# Altium project Magnetic-Sequencer.PrjPcb
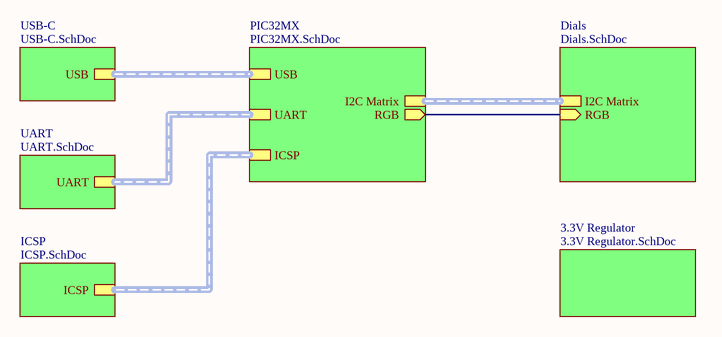
[diagram p0: Main.SchDoc]
Author: Seb Madgwick; Project: Magnetic Sequencer; Version: v1.1
8 sheets, 301 parts. Net scope: hierarchical (ports join the sheet entries above them; power ports are global).
Board file: Magnetic-Sequencer.PcbDoc
Sheets:
  Main.SchDoc
    Dials = Dials.SchDoc
      CH1 = Dial.SchDoc
      CH2 = Dial.SchDoc
      CH3 = Dial.SchDoc
      CH4 = Dial.SchDoc
      CH5 = Dial.SchDoc
      CH6 = Dial.SchDoc
      CH7 = Dial.SchDoc
      CH8 = Dial.SchDoc
      CH9 = Dial.SchDoc
      CH10 = Dial.SchDoc
      CH11 = Dial.SchDoc
      CH12 = Dial.SchDoc
      CH13 = Dial.SchDoc
      CH14 = Dial.SchDoc
      CH15 = Dial.SchDoc
      CH16 = Dial.SchDoc
      CH17 = Dial.SchDoc
      CH18 = Dial.SchDoc
      CH19 = Dial.SchDoc
      CH20 = Dial.SchDoc
      CH21 = Dial.SchDoc
      CH22 = Dial.SchDoc
      CH23 = Dial.SchDoc
      CH24 = Dial.SchDoc
      CH25 = Dial.SchDoc
      CH26 = Dial.SchDoc
      CH27 = Dial.SchDoc
      CH28 = Dial.SchDoc
      CH29 = Dial.SchDoc
      CH30 = Dial.SchDoc
      CH31 = Dial.SchDoc
      CH32 = Dial.SchDoc
      CH33 = Dial.SchDoc
      CH34 = Dial.SchDoc
      CH35 = Dial.SchDoc
      CH36 = Dial.SchDoc
      CH37 = Dial.SchDoc
      CH38 = Dial.SchDoc
      CH39 = Dial.SchDoc
      CH40 = Dial.SchDoc
      CH41 = Dial.SchDoc
      CH42 = Dial.SchDoc
      CH43 = Dial.SchDoc
      CH44 = Dial.SchDoc
      CH45 = Dial.SchDoc
      CH46 = Dial.SchDoc
      CH47 = Dial.SchDoc
      CH48 = Dial.SchDoc
      CH49 = Dial.SchDoc
      CH50 = Dial.SchDoc
      CH51 = Dial.SchDoc
      CH52 = Dial.SchDoc
      CH53 = Dial.SchDoc
      CH54 = Dial.SchDoc
      CH55 = Dial.SchDoc
      CH56 = Dial.SchDoc
      CH57 = Dial.SchDoc
      CH58 = Dial.SchDoc
      CH59 = Dial.SchDoc
      CH60 = Dial.SchDoc
      CH61 = Dial.SchDoc
      CH62 = Dial.SchDoc
      CH63 = Dial.SchDoc
      CH64 = Dial.SchDoc
    PIC32MX = PIC32MX.SchDoc
    USB-C = USB-C.SchDoc
    UART = UART.SchDoc
    3.3V Regulator = 3.3V Regulator.SchDoc
    ICSP = ICSP.SchDoc

## Sheet Main.SchDoc
size A4; SheetNumber: 1; SheetTotal: 8

### Sub-sheets
3.3V Regulator = 3.3V Regulator.SchDoc: no entries
Dials = Dials.SchDoc: I2C Matrix (harness I2C Matrix), RGB (in)
ICSP = ICSP.SchDoc: ICSP (harness ICSP)
PIC32MX = PIC32MX.SchDoc: I2C Matrix (harness I2C Matrix), RGB (out), USB (harness USB), ICSP (harness ICSP), UART (harness UART)
UART = UART.SchDoc: UART (harness UART)
USB-C = USB-C.SchDoc: USB (harness USB)

### Nets
RGB: sheet Dials/RGB, sheet PIC32MX/RGB

### Buses and harness runs
harness sheet Dials/I2C Matrix = sheet PIC32MX/I2C Matrix
harness sheet ICSP/ICSP = sheet PIC32MX/ICSP
harness sheet PIC32MX/UART = sheet UART/UART
harness sheet PIC32MX/USB = sheet USB-C/USB

### Notes on the sheet
- TITLE
- SIZE
- A4
- VARIANT
- PROJECT
- SHEET
- VERSION
- OF
- AUTHOR
- DATE

## Sheet Dials.SchDoc
size A3; SheetNumber: 6; SheetTotal: 8
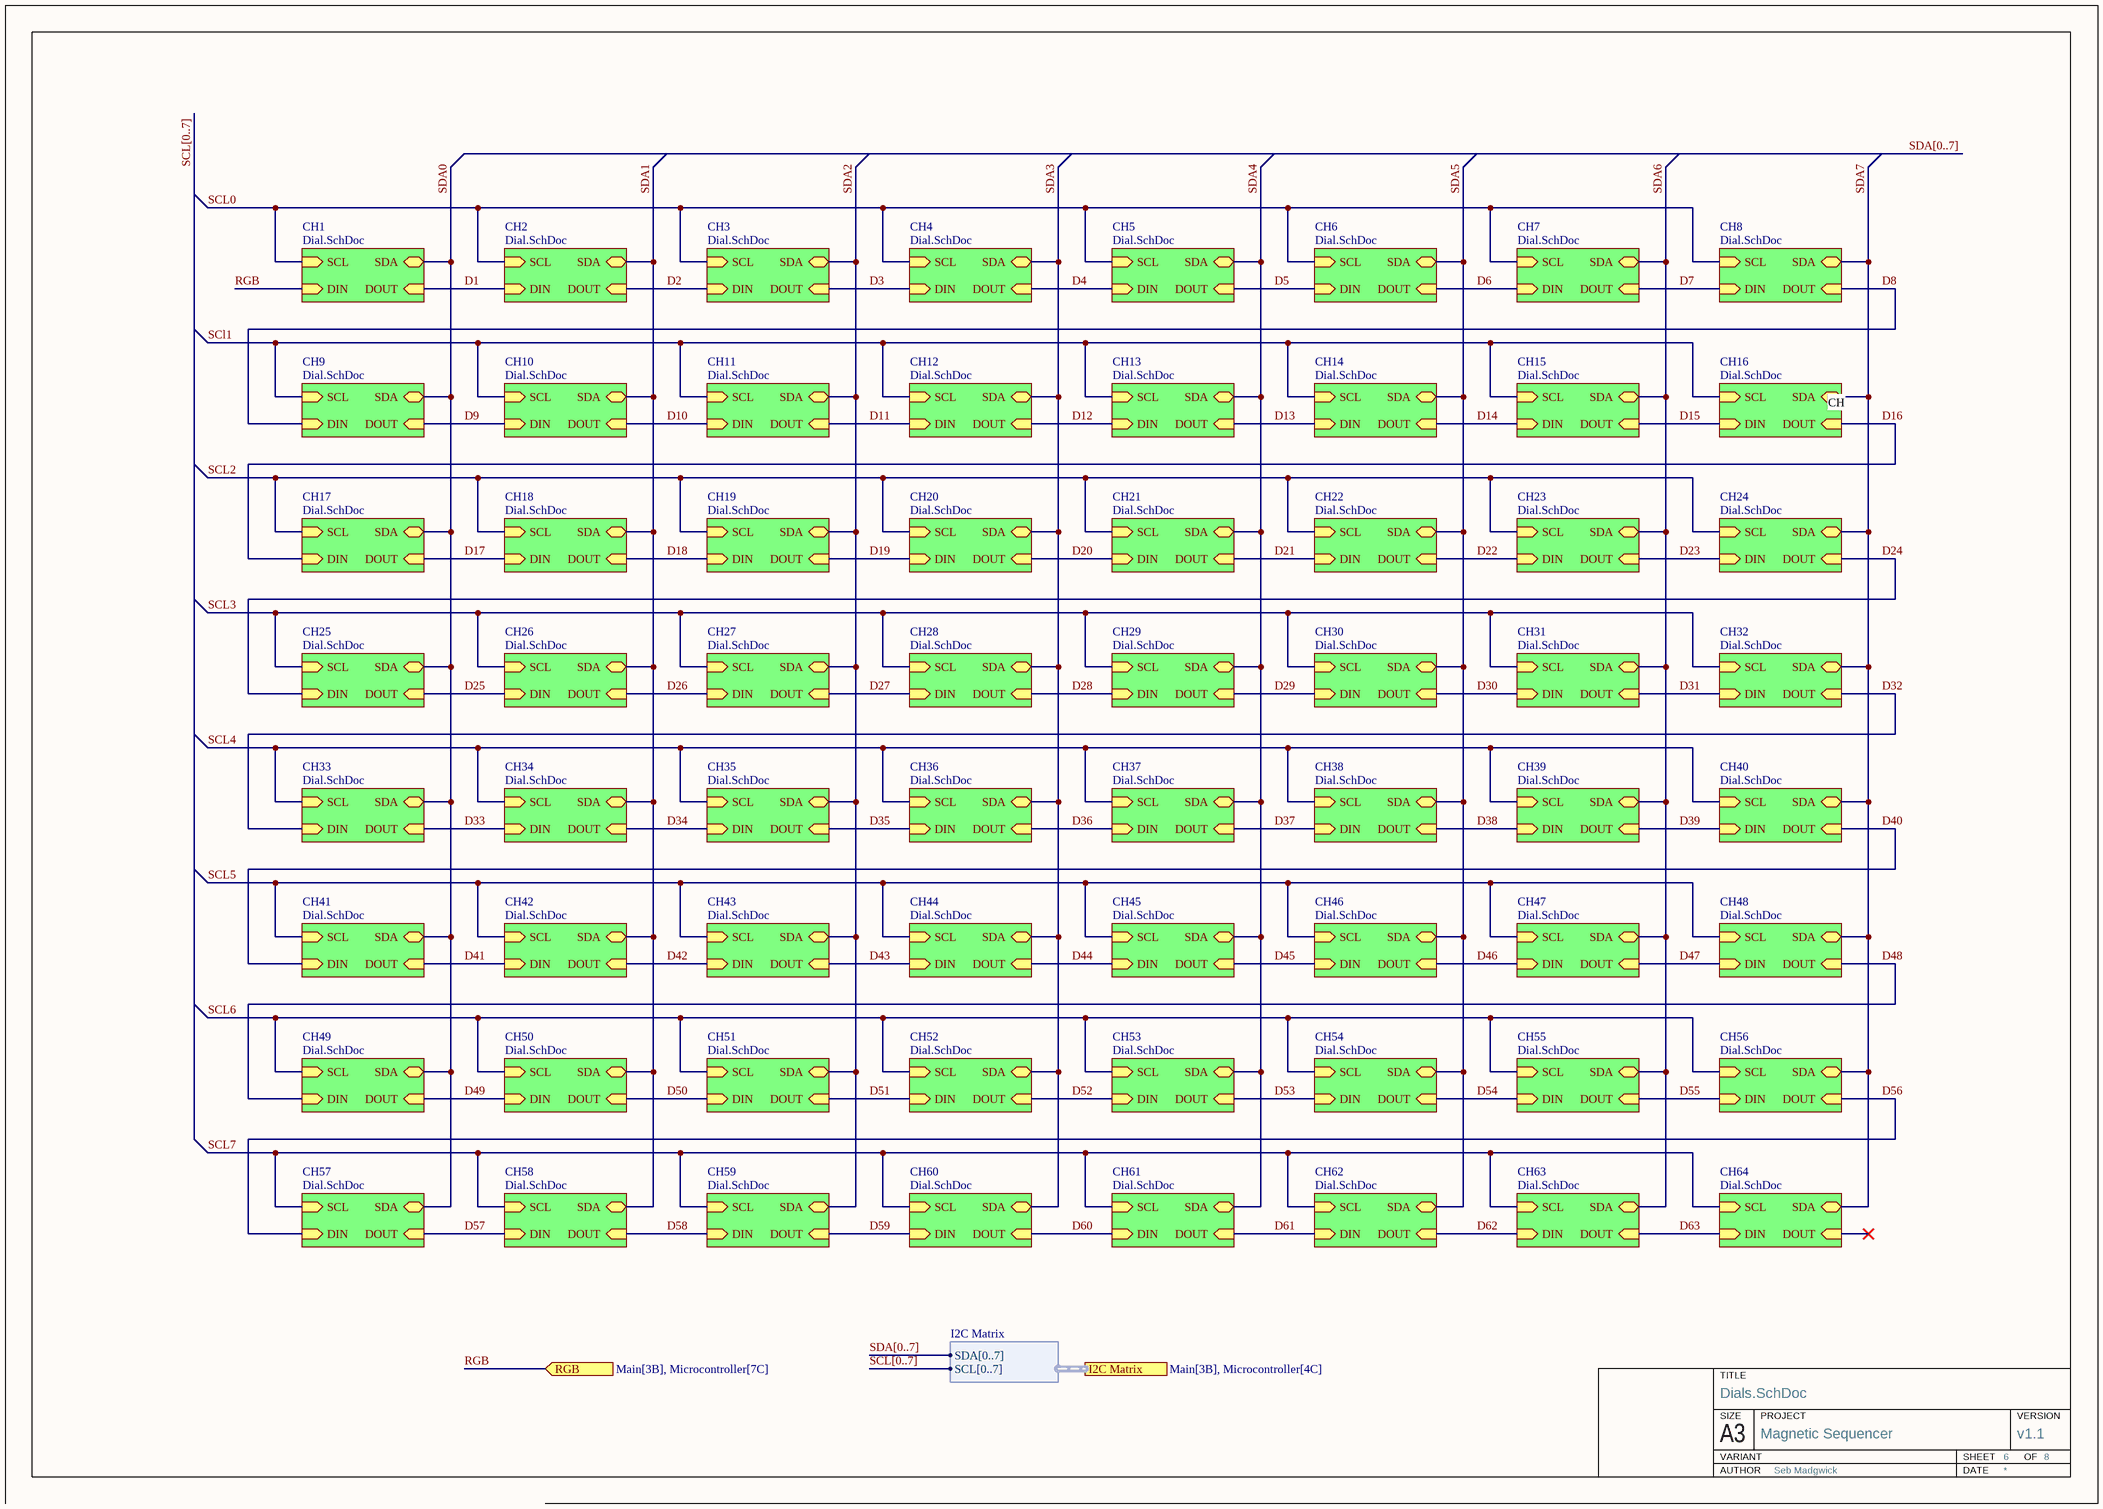
[diagram p1: Dials.SchDoc]

### Sub-sheets
CH1 = Dial.SchDoc: SCL (in), SDA (bidir), DIN (in), DOUT (in)
CH2 = Dial.SchDoc: SCL (in), SDA (bidir), DIN (in), DOUT (in)
CH3 = Dial.SchDoc: SCL (in), SDA (bidir), DIN (in), DOUT (in)
CH4 = Dial.SchDoc: SCL (in), SDA (bidir), DIN (in), DOUT (in)
CH5 = Dial.SchDoc: SCL (in), SDA (bidir), DIN (in), DOUT (in)
CH6 = Dial.SchDoc: SCL (in), SDA (bidir), DIN (in), DOUT (in)
CH7 = Dial.SchDoc: SCL (in), SDA (bidir), DIN (in), DOUT (in)
CH8 = Dial.SchDoc: SCL (in), SDA (bidir), DIN (in), DOUT (in)
CH9 = Dial.SchDoc: SCL (in), SDA (bidir), DIN (in), DOUT (in)
CH10 = Dial.SchDoc: SCL (in), SDA (bidir), DIN (in), DOUT (in)
CH11 = Dial.SchDoc: SCL (in), SDA (bidir), DIN (in), DOUT (in)
CH12 = Dial.SchDoc: SCL (in), SDA (bidir), DIN (in), DOUT (in)
CH13 = Dial.SchDoc: SCL (in), SDA (bidir), DIN (in), DOUT (in)
CH14 = Dial.SchDoc: SCL (in), SDA (bidir), DIN (in), DOUT (in)
CH15 = Dial.SchDoc: SCL (in), SDA (bidir), DIN (in), DOUT (in)
CH16 = Dial.SchDoc: SCL (in), SDA (bidir), DIN (in), DOUT (in)
CH17 = Dial.SchDoc: SCL (in), SDA (bidir), DIN (in), DOUT (in)
CH18 = Dial.SchDoc: SCL (in), SDA (bidir), DIN (in), DOUT (in)
CH19 = Dial.SchDoc: SCL (in), SDA (bidir), DIN (in), DOUT (in)
CH20 = Dial.SchDoc: SCL (in), SDA (bidir), DIN (in), DOUT (in)
CH21 = Dial.SchDoc: SCL (in), SDA (bidir), DIN (in), DOUT (in)
CH22 = Dial.SchDoc: SCL (in), SDA (bidir), DIN (in), DOUT (in)
CH23 = Dial.SchDoc: SCL (in), SDA (bidir), DIN (in), DOUT (in)
CH24 = Dial.SchDoc: SCL (in), SDA (bidir), DIN (in), DOUT (in)
CH25 = Dial.SchDoc: SCL (in), SDA (bidir), DIN (in), DOUT (in)
CH26 = Dial.SchDoc: SCL (in), SDA (bidir), DIN (in), DOUT (in)
CH27 = Dial.SchDoc: SCL (in), SDA (bidir), DIN (in), DOUT (in)
CH28 = Dial.SchDoc: SCL (in), SDA (bidir), DIN (in), DOUT (in)
CH29 = Dial.SchDoc: SCL (in), SDA (bidir), DIN (in), DOUT (in)
CH30 = Dial.SchDoc: SCL (in), SDA (bidir), DIN (in), DOUT (in)
CH31 = Dial.SchDoc: SCL (in), SDA (bidir), DIN (in), DOUT (in)
CH32 = Dial.SchDoc: SCL (in), SDA (bidir), DIN (in), DOUT (in)
CH33 = Dial.SchDoc: SCL (in), SDA (bidir), DIN (in), DOUT (in)
CH34 = Dial.SchDoc: SCL (in), SDA (bidir), DIN (in), DOUT (in)
CH35 = Dial.SchDoc: SCL (in), SDA (bidir), DIN (in), DOUT (in)
CH36 = Dial.SchDoc: SCL (in), SDA (bidir), DIN (in), DOUT (in)
CH37 = Dial.SchDoc: SCL (in), SDA (bidir), DIN (in), DOUT (in)
CH38 = Dial.SchDoc: SCL (in), SDA (bidir), DIN (in), DOUT (in)
CH39 = Dial.SchDoc: SCL (in), SDA (bidir), DIN (in), DOUT (in)
CH40 = Dial.SchDoc: SCL (in), SDA (bidir), DIN (in), DOUT (in)
CH41 = Dial.SchDoc: SCL (in), SDA (bidir), DIN (in), DOUT (in)
CH42 = Dial.SchDoc: SCL (in), SDA (bidir), DIN (in), DOUT (in)
CH43 = Dial.SchDoc: SCL (in), SDA (bidir), DIN (in), DOUT (in)
CH44 = Dial.SchDoc: SCL (in), SDA (bidir), DIN (in), DOUT (in)
CH45 = Dial.SchDoc: SCL (in), SDA (bidir), DIN (in), DOUT (in)
CH46 = Dial.SchDoc: SCL (in), SDA (bidir), DIN (in), DOUT (in)
CH47 = Dial.SchDoc: SCL (in), SDA (bidir), DIN (in), DOUT (in)
CH48 = Dial.SchDoc: SCL (in), SDA (bidir), DIN (in), DOUT (in)
CH49 = Dial.SchDoc: SCL (in), SDA (bidir), DIN (in), DOUT (in)
CH50 = Dial.SchDoc: SCL (in), SDA (bidir), DIN (in), DOUT (in)
CH51 = Dial.SchDoc: SCL (in), SDA (bidir), DIN (in), DOUT (in)
CH52 = Dial.SchDoc: SCL (in), SDA (bidir), DIN (in), DOUT (in)
CH53 = Dial.SchDoc: SCL (in), SDA (bidir), DIN (in), DOUT (in)
CH54 = Dial.SchDoc: SCL (in), SDA (bidir), DIN (in), DOUT (in)
CH55 = Dial.SchDoc: SCL (in), SDA (bidir), DIN (in), DOUT (in)
CH56 = Dial.SchDoc: SCL (in), SDA (bidir), DIN (in), DOUT (in)
CH57 = Dial.SchDoc: SCL (in), SDA (bidir), DIN (in), DOUT (in)
CH58 = Dial.SchDoc: SCL (in), SDA (bidir), DIN (in), DOUT (in)
CH59 = Dial.SchDoc: SCL (in), SDA (bidir), DIN (in), DOUT (in)
CH60 = Dial.SchDoc: SCL (in), SDA (bidir), DIN (in), DOUT (in)
CH61 = Dial.SchDoc: SCL (in), SDA (bidir), DIN (in), DOUT (in)
CH62 = Dial.SchDoc: SCL (in), SDA (bidir), DIN (in), DOUT (in)
CH63 = Dial.SchDoc: SCL (in), SDA (bidir), DIN (in), DOUT (in)
CH64 = Dial.SchDoc: SCL (in), SDA (bidir), DIN (in), DOUT (in)

### Ports
I2C Matrix (harness I2C Matrix, see Main[3B], Microcontroller[4C]), RGB (in, see Main[3B], Microcontroller[7C])

### Harnesses
I2C Matrix: SDA[0..7], SCL[0..7]

### Nets
D1: sheet CH1/DOUT, sheet CH2/DIN
D2: sheet CH2/DOUT, sheet CH3/DIN
D3: sheet CH3/DOUT, sheet CH4/DIN
D4: sheet CH4/DOUT, sheet CH5/DIN
D5: sheet CH5/DOUT, sheet CH6/DIN
D6: sheet CH6/DOUT, sheet CH7/DIN
D7: sheet CH7/DOUT, sheet CH8/DIN
D8: sheet CH8/DOUT, sheet CH9/DIN
D9: sheet CH9/DOUT, sheet CH10/DIN
D10: sheet CH10/DOUT, sheet CH11/DIN
D11: sheet CH11/DOUT, sheet CH12/DIN
D12: sheet CH12/DOUT, sheet CH13/DIN
D13: sheet CH13/DOUT, sheet CH14/DIN
D14: sheet CH14/DOUT, sheet CH15/DIN
D15: sheet CH15/DOUT, sheet CH16/DIN
D16: sheet CH16/DOUT, sheet CH17/DIN
D17: sheet CH17/DOUT, sheet CH18/DIN
D18: sheet CH18/DOUT, sheet CH19/DIN
D19: sheet CH19/DOUT, sheet CH20/DIN
D20: sheet CH20/DOUT, sheet CH21/DIN
D21: sheet CH21/DOUT, sheet CH22/DIN
D22: sheet CH22/DOUT, sheet CH23/DIN
D23: sheet CH23/DOUT, sheet CH24/DIN
D24: sheet CH24/DOUT, sheet CH25/DIN
D25: sheet CH25/DOUT, sheet CH26/DIN
D26: sheet CH26/DOUT, sheet CH27/DIN
D27: sheet CH27/DOUT, sheet CH28/DIN
D28: sheet CH28/DOUT, sheet CH29/DIN
D29: sheet CH29/DOUT, sheet CH30/DIN
D30: sheet CH30/DOUT, sheet CH31/DIN
D31: sheet CH31/DOUT, sheet CH32/DIN
D32: sheet CH32/DOUT, sheet CH33/DIN
D33: sheet CH33/DOUT, sheet CH34/DIN
D34: sheet CH34/DOUT, sheet CH35/DIN
D35: sheet CH35/DOUT, sheet CH36/DIN
D36: sheet CH36/DOUT, sheet CH37/DIN
D37: sheet CH37/DOUT, sheet CH38/DIN
D38: sheet CH38/DOUT, sheet CH39/DIN
D39: sheet CH39/DOUT, sheet CH40/DIN
D40: sheet CH40/DOUT, sheet CH41/DIN
D41: sheet CH41/DOUT, sheet CH42/DIN
D42: sheet CH42/DOUT, sheet CH43/DIN
D43: sheet CH43/DOUT, sheet CH44/DIN
D44: sheet CH44/DOUT, sheet CH45/DIN
D45: sheet CH45/DOUT, sheet CH46/DIN
D46: sheet CH46/DOUT, sheet CH47/DIN
D47: sheet CH47/DOUT, sheet CH48/DIN
D48: sheet CH48/DOUT, sheet CH49/DIN
D49: sheet CH49/DOUT, sheet CH50/DIN
D50: sheet CH50/DOUT, sheet CH51/DIN
D51: sheet CH51/DOUT, sheet CH52/DIN
D52: sheet CH52/DOUT, sheet CH53/DIN
D53: sheet CH53/DOUT, sheet CH54/DIN
D54: sheet CH54/DOUT, sheet CH55/DIN
D55: sheet CH55/DOUT, sheet CH56/DIN
D56: sheet CH56/DOUT, sheet CH57/DIN
D57: sheet CH57/DOUT, sheet CH58/DIN
D58: sheet CH58/DOUT, sheet CH59/DIN
D59: sheet CH59/DOUT, sheet CH60/DIN
D60: sheet CH60/DOUT, sheet CH61/DIN
D61: sheet CH61/DOUT, sheet CH62/DIN
D62: sheet CH62/DOUT, sheet CH63/DIN
D63: sheet CH63/DOUT, sheet CH64/DIN
RGB: port RGB, sheet CH1/DIN
SCL0: sheet CH1/SCL, sheet CH2/SCL, sheet CH3/SCL, sheet CH4/SCL, sheet CH5/SCL, sheet CH6/SCL, sheet CH7/SCL, sheet CH8/SCL
SCl1: sheet CH9/SCL, sheet CH10/SCL, sheet CH11/SCL, sheet CH12/SCL, sheet CH13/SCL, sheet CH14/SCL, sheet CH15/SCL, sheet CH16/SCL
SCL2: sheet CH17/SCL, sheet CH18/SCL, sheet CH19/SCL, sheet CH20/SCL, sheet CH21/SCL, sheet CH22/SCL, sheet CH23/SCL, sheet CH24/SCL
SCL3: sheet CH25/SCL, sheet CH26/SCL, sheet CH27/SCL, sheet CH28/SCL, sheet CH29/SCL, sheet CH30/SCL, sheet CH31/SCL, sheet CH32/SCL
SCL4: sheet CH33/SCL, sheet CH34/SCL, sheet CH35/SCL, sheet CH36/SCL, sheet CH37/SCL, sheet CH38/SCL, sheet CH39/SCL, sheet CH40/SCL
SCL5: sheet CH41/SCL, sheet CH42/SCL, sheet CH43/SCL, sheet CH44/SCL, sheet CH45/SCL, sheet CH46/SCL, sheet CH47/SCL, sheet CH48/SCL
SCL6: sheet CH49/SCL, sheet CH50/SCL, sheet CH51/SCL, sheet CH52/SCL, sheet CH53/SCL, sheet CH54/SCL, sheet CH55/SCL, sheet CH56/SCL
SCL7: sheet CH57/SCL, sheet CH58/SCL, sheet CH59/SCL, sheet CH60/SCL, sheet CH61/SCL, sheet CH62/SCL, sheet CH63/SCL, sheet CH64/SCL
SDA0: sheet CH1/SDA, sheet CH9/SDA, sheet CH17/SDA, sheet CH25/SDA, sheet CH33/SDA, sheet CH41/SDA, sheet CH49/SDA, sheet CH57/SDA
SDA1: sheet CH2/SDA, sheet CH10/SDA, sheet CH18/SDA, sheet CH26/SDA, sheet CH34/SDA, sheet CH42/SDA, sheet CH50/SDA, sheet CH58/SDA
SDA2: sheet CH3/SDA, sheet CH11/SDA, sheet CH19/SDA, sheet CH27/SDA, sheet CH35/SDA, sheet CH43/SDA, sheet CH51/SDA, sheet CH59/SDA
SDA3: sheet CH4/SDA, sheet CH12/SDA, sheet CH20/SDA, sheet CH28/SDA, sheet CH36/SDA, sheet CH44/SDA, sheet CH52/SDA, sheet CH60/SDA
SDA4: sheet CH5/SDA, sheet CH13/SDA, sheet CH21/SDA, sheet CH29/SDA, sheet CH37/SDA, sheet CH45/SDA, sheet CH53/SDA, sheet CH61/SDA
SDA5: sheet CH6/SDA, sheet CH14/SDA, sheet CH22/SDA, sheet CH30/SDA, sheet CH38/SDA, sheet CH46/SDA, sheet CH54/SDA, sheet CH62/SDA
SDA6: sheet CH7/SDA, sheet CH15/SDA, sheet CH23/SDA, sheet CH31/SDA, sheet CH39/SDA, sheet CH47/SDA, sheet CH55/SDA, sheet CH63/SDA
SDA7: sheet CH8/SDA, sheet CH16/SDA, sheet CH24/SDA, sheet CH32/SDA, sheet CH40/SDA, sheet CH48/SDA, sheet CH56/SDA, sheet CH64/SDA

### Buses and harness runs
bus SCL[0..7]
bus SDA[0..7]

### Notes on the sheet
- CH
- TITLE
- SIZE
- A3
- VARIANT
- PROJECT
- SHEET
- VERSION
- OF
- AUTHOR
- DATE

## Sheet Dial.SchDoc
size A4; SheetNumber: 7; SheetTotal: 8
Used 64 times, as channels Dials/CH1, Dials/CH2, Dials/CH3, Dials/CH4, Dials/CH5, Dials/CH6, Dials/CH7, Dials/CH8, Dials/CH9, Dials/CH10, Dials/CH11, Dials/CH12, Dials/CH13, Dials/CH14, Dials/CH15, Dials/CH16, Dials/CH17, Dials/CH18, Dials/CH19, Dials/CH20, Dials/CH21, Dials/CH22, Dials/CH23, Dials/CH24, Dials/CH25, Dials/CH26, Dials/CH27, Dials/CH28, Dials/CH29, Dials/CH30, Dials/CH31, Dials/CH32, Dials/CH33, Dials/CH34, Dials/CH35, Dials/CH36, Dials/CH37, Dials/CH38, Dials/CH39, Dials/CH40, Dials/CH41, Dials/CH42, Dials/CH43, Dials/CH44, Dials/CH45, Dials/CH46, Dials/CH47, Dials/CH48, Dials/CH49, Dials/CH50, Dials/CH51, Dials/CH52, Dials/CH53, Dials/CH54, Dials/CH55, Dials/CH56, Dials/CH57, Dials/CH58, Dials/CH59, Dials/CH60, Dials/CH61, Dials/CH62, Dials/CH63, Dials/CH64. Parts and nets are listed once, with the designators drawn on the sheet.
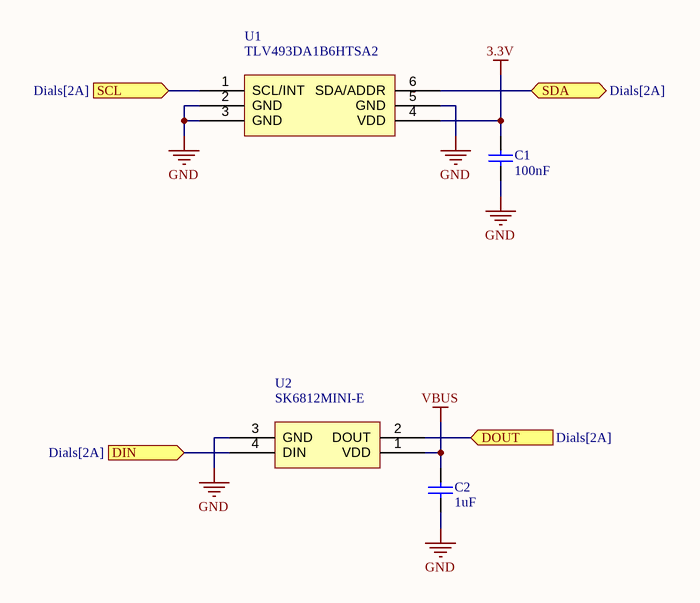
[diagram p2: Dial.SchDoc]

### Parts
C1  100nF  [Capacitor 0603]
C2  1uF  [Capacitor 0603]
U1  TLV493DA1B6HTSA2  [SOT-23-6]
U2  SK6812MINI-E  [SK6812MINI-E]

### Ports
DIN (in, see Dials[2A]), DOUT (in, see Dials[2A]), SCL (in, see Dials[2A]), SDA (bidir, see Dials[2A])

### Nets
3.3V: C1.2 U1.4(VDD)
GND: C1.1 C2.1 U1.2(GND) U1.3(GND) U1.5(GND) U2.3(GND)
VBUS: C2.2 U2.1(VDD)
DIN: U2.4(DIN) ; port DIN
DOUT: U2.2(DOUT) ; port DOUT
SCL: U1.1(SCL/INT) ; port SCL
SDA: U1.6(SDA/ADDR) ; port SDA

### Channels
Dials/CH1: designators end in _CH1; ports DIN=RGB DOUT=D1 SCL=SCL0 SDA=SDA0
Dials/CH2: designators end in _CH2; ports DIN=D1 DOUT=D2 SCL=SCL0 SDA=SDA1
Dials/CH3: designators end in _CH3; ports DIN=D2 DOUT=D3 SCL=SCL0 SDA=SDA2
Dials/CH4: designators end in _CH4; ports DIN=D3 DOUT=D4 SCL=SCL0 SDA=SDA3
Dials/CH5: designators end in _CH5; ports DIN=D4 DOUT=D5 SCL=SCL0 SDA=SDA4
Dials/CH6: designators end in _CH6; ports DIN=D5 DOUT=D6 SCL=SCL0 SDA=SDA5
Dials/CH7: designators end in _CH7; ports DIN=D6 DOUT=D7 SCL=SCL0 SDA=SDA6
Dials/CH8: designators end in _CH8; ports DIN=D7 DOUT=D8 SCL=SCL0 SDA=SDA7
Dials/CH9: designators end in _CH9; ports DIN=D8 DOUT=D9 SCL=SCl1 SDA=SDA0
Dials/CH10: designators end in _CH10; ports DIN=D9 DOUT=D10 SCL=SCl1 SDA=SDA1
Dials/CH11: designators end in _CH11; ports DIN=D10 DOUT=D11 SCL=SCl1 SDA=SDA2
Dials/CH12: designators end in _CH12; ports DIN=D11 DOUT=D12 SCL=SCl1 SDA=SDA3
Dials/CH13: designators end in _CH13; ports DIN=D12 DOUT=D13 SCL=SCl1 SDA=SDA4
Dials/CH14: designators end in _CH14; ports DIN=D13 DOUT=D14 SCL=SCl1 SDA=SDA5
Dials/CH15: designators end in _CH15; ports DIN=D14 DOUT=D15 SCL=SCl1 SDA=SDA6
Dials/CH16: designators end in _CH16; ports DIN=D15 DOUT=D16 SCL=SCl1 SDA=SDA7
Dials/CH17: designators end in _CH17; ports DIN=D16 DOUT=D17 SCL=SCL2 SDA=SDA0
Dials/CH18: designators end in _CH18; ports DIN=D17 DOUT=D18 SCL=SCL2 SDA=SDA1
Dials/CH19: designators end in _CH19; ports DIN=D18 DOUT=D19 SCL=SCL2 SDA=SDA2
Dials/CH20: designators end in _CH20; ports DIN=D19 DOUT=D20 SCL=SCL2 SDA=SDA3
Dials/CH21: designators end in _CH21; ports DIN=D20 DOUT=D21 SCL=SCL2 SDA=SDA4
Dials/CH22: designators end in _CH22; ports DIN=D21 DOUT=D22 SCL=SCL2 SDA=SDA5
Dials/CH23: designators end in _CH23; ports DIN=D22 DOUT=D23 SCL=SCL2 SDA=SDA6
Dials/CH24: designators end in _CH24; ports DIN=D23 DOUT=D24 SCL=SCL2 SDA=SDA7
Dials/CH25: designators end in _CH25; ports DIN=D24 DOUT=D25 SCL=SCL3 SDA=SDA0
Dials/CH26: designators end in _CH26; ports DIN=D25 DOUT=D26 SCL=SCL3 SDA=SDA1
Dials/CH27: designators end in _CH27; ports DIN=D26 DOUT=D27 SCL=SCL3 SDA=SDA2
Dials/CH28: designators end in _CH28; ports DIN=D27 DOUT=D28 SCL=SCL3 SDA=SDA3
Dials/CH29: designators end in _CH29; ports DIN=D28 DOUT=D29 SCL=SCL3 SDA=SDA4
Dials/CH30: designators end in _CH30; ports DIN=D29 DOUT=D30 SCL=SCL3 SDA=SDA5
Dials/CH31: designators end in _CH31; ports DIN=D30 DOUT=D31 SCL=SCL3 SDA=SDA6
Dials/CH32: designators end in _CH32; ports DIN=D31 DOUT=D32 SCL=SCL3 SDA=SDA7
Dials/CH33: designators end in _CH33; ports DIN=D32 DOUT=D33 SCL=SCL4 SDA=SDA0
Dials/CH34: designators end in _CH34; ports DIN=D33 DOUT=D34 SCL=SCL4 SDA=SDA1
Dials/CH35: designators end in _CH35; ports DIN=D34 DOUT=D35 SCL=SCL4 SDA=SDA2
Dials/CH36: designators end in _CH36; ports DIN=D35 DOUT=D36 SCL=SCL4 SDA=SDA3
Dials/CH37: designators end in _CH37; ports DIN=D36 DOUT=D37 SCL=SCL4 SDA=SDA4
Dials/CH38: designators end in _CH38; ports DIN=D37 DOUT=D38 SCL=SCL4 SDA=SDA5
Dials/CH39: designators end in _CH39; ports DIN=D38 DOUT=D39 SCL=SCL4 SDA=SDA6
Dials/CH40: designators end in _CH40; ports DIN=D39 DOUT=D40 SCL=SCL4 SDA=SDA7
Dials/CH41: designators end in _CH41; ports DIN=D40 DOUT=D41 SCL=SCL5 SDA=SDA0
Dials/CH42: designators end in _CH42; ports DIN=D41 DOUT=D42 SCL=SCL5 SDA=SDA1
Dials/CH43: designators end in _CH43; ports DIN=D42 DOUT=D43 SCL=SCL5 SDA=SDA2
Dials/CH44: designators end in _CH44; ports DIN=D43 DOUT=D44 SCL=SCL5 SDA=SDA3
Dials/CH45: designators end in _CH45; ports DIN=D44 DOUT=D45 SCL=SCL5 SDA=SDA4
Dials/CH46: designators end in _CH46; ports DIN=D45 DOUT=D46 SCL=SCL5 SDA=SDA5
Dials/CH47: designators end in _CH47; ports DIN=D46 DOUT=D47 SCL=SCL5 SDA=SDA6
Dials/CH48: designators end in _CH48; ports DIN=D47 DOUT=D48 SCL=SCL5 SDA=SDA7
Dials/CH49: designators end in _CH49; ports DIN=D48 DOUT=D49 SCL=SCL6 SDA=SDA0
Dials/CH50: designators end in _CH50; ports DIN=D49 DOUT=D50 SCL=SCL6 SDA=SDA1
Dials/CH51: designators end in _CH51; ports DIN=D50 DOUT=D51 SCL=SCL6 SDA=SDA2
Dials/CH52: designators end in _CH52; ports DIN=D51 DOUT=D52 SCL=SCL6 SDA=SDA3
Dials/CH53: designators end in _CH53; ports DIN=D52 DOUT=D53 SCL=SCL6 SDA=SDA4
Dials/CH54: designators end in _CH54; ports DIN=D53 DOUT=D54 SCL=SCL6 SDA=SDA5
Dials/CH55: designators end in _CH55; ports DIN=D54 DOUT=D55 SCL=SCL6 SDA=SDA6
Dials/CH56: designators end in _CH56; ports DIN=D55 DOUT=D56 SCL=SCL6 SDA=SDA7
Dials/CH57: designators end in _CH57; ports DIN=D56 DOUT=D57 SCL=SCL7 SDA=SDA0
Dials/CH58: designators end in _CH58; ports DIN=D57 DOUT=D58 SCL=SCL7 SDA=SDA1
Dials/CH59: designators end in _CH59; ports DIN=D58 DOUT=D59 SCL=SCL7 SDA=SDA2
Dials/CH60: designators end in _CH60; ports DIN=D59 DOUT=D60 SCL=SCL7 SDA=SDA3
Dials/CH61: designators end in _CH61; ports DIN=D60 DOUT=D61 SCL=SCL7 SDA=SDA4
Dials/CH62: designators end in _CH62; ports DIN=D61 DOUT=D62 SCL=SCL7 SDA=SDA5
Dials/CH63: designators end in _CH63; ports DIN=D62 DOUT=D63 SCL=SCL7 SDA=SDA6
Dials/CH64: designators end in _CH64; ports DIN=D63 DOUT=NetU2_CH64_2 SCL=SCL7 SDA=SDA7

### Notes on the sheet
- TITLE
- SIZE
- A4
- VARIANT
- PROJECT
- SHEET
- VERSION
- OF
- AUTHOR
- DATE

### Library data of the parts
C1 C2 = Capacitor

## Sheet PIC32MX.SchDoc
size A3; SheetNumber: 2; SheetTotal: 8
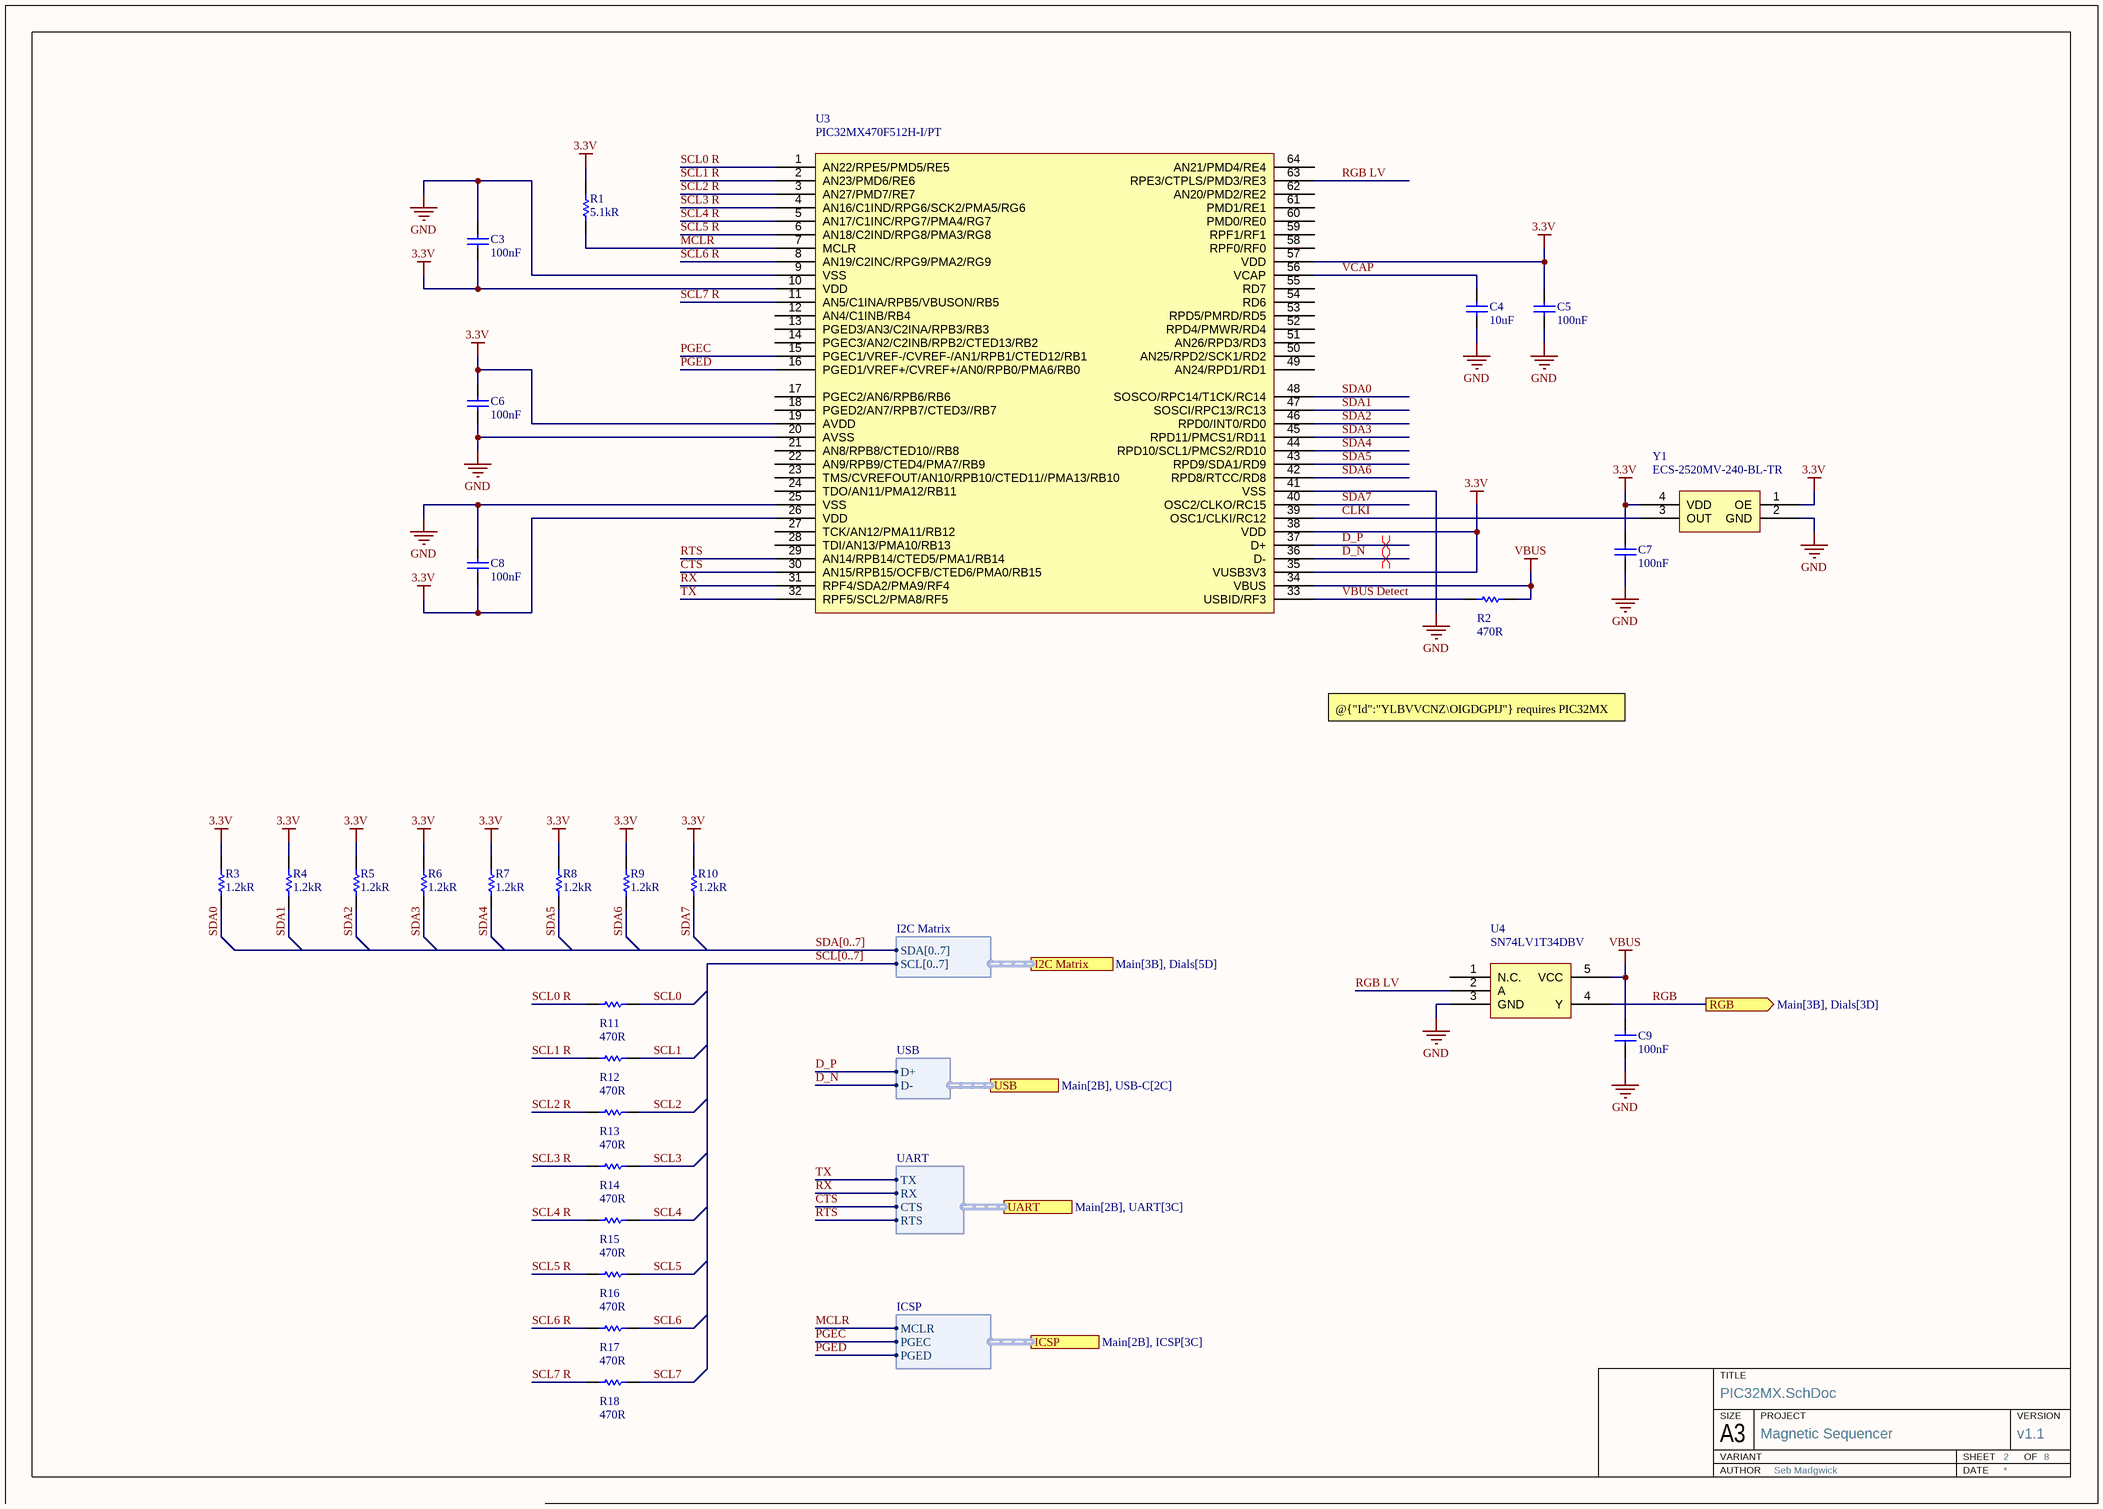
[diagram p3: PIC32MX.SchDoc]

### Parts
C3  100nF  [Capacitor 0603]
C4  10uF  [Capacitor 0603]
C5  100nF  [Capacitor 0603]
C6  100nF  [Capacitor 0603]
C7  100nF  [Capacitor 0603]
C8  100nF  [Capacitor 0603]
C9  100nF  [Capacitor 0603]
R1  5.1kR  [Resistor 0603]
R2  470R  [Resistor 0603]
R3  1.2kR  [Resistor 0603]
R4  1.2kR  [Resistor 0603]
R5  1.2kR  [Resistor 0603]
R6  1.2kR  [Resistor 0603]
R7  1.2kR  [Resistor 0603]
R8  1.2kR  [Resistor 0603]
R9  1.2kR  [Resistor 0603]
R10  1.2kR  [Resistor 0603]
R11  470R  [Resistor 0603]
R12  470R  [Resistor 0603]
R13  470R  [Resistor 0603]
R14  470R  [Resistor 0603]
R15  470R  [Resistor 0603]
R16  470R  [Resistor 0603]
R17  470R  [Resistor 0603]
R18  470R  [Resistor 0603]
U3  PIC32MX470F512H-I/PT  [TQFP-64]
U4  SN74LV1T34DBV  [SOT-23-5]
Y1  ECS-2520MV-240-BL-TR  [ECS-2520MV-240-BL-TR]

### Ports
I2C Matrix (harness I2C Matrix, see Main[3B], Dials[5D]), ICSP (harness ICSP, see Main[2B], ICSP[3C]), RGB (out, see Main[3B], Dials[3D]), UART (harness UART, see Main[2B], UART[3C]), USB (harness USB, see Main[2B], USB-C[2C])

### Harnesses
I2C Matrix: SDA[0..7], SCL[0..7]
USB: D+, D-
ICSP: MCLR, PGEC, PGED
UART: TX, RX, CTS, RTS

### Nets
3.3V: C3.1 C5.2 C6.2 C7.2 C8.1 R1.2 R3.2 R4.2 R5.2 R6.2 R7.2 R8.2 R9.2 R10.2 U3.10(VDD) U3.19(AVDD) U3.26(VDD) U3.35(VUSB3V3) U3.38(VDD) U3.57(VDD) Y1.1(OE) Y1.4(VDD)
GND: C3.2 C4.1 C5.1 C6.1 C7.1 C8.2 C9.1 U3.9(VSS) U3.20(AVSS) U3.25(VSS) U3.41(VSS) U4.3(GND) Y1.2(GND)
VBUS: C9.2 R2.2 U3.34(VBUS) U4.5(VCC)
CLKI: U3.39(OSC1/CLKI/RC12) Y1.3(OUT)
CTS: U3.30(AN15/RPB15/OCFB/CTED6/PMA0/RB15) ; port UART.CTS
D_N: U3.36(D-) ; port USB.D-
D_P: U3.37(D+) ; port USB.D+
MCLR: R1.1 U3.7(MCLR) ; port ICSP.MCLR
PGEC: U3.15(PGEC1/VREF-/CVREF-/AN1/RPB1/CTED12/RB1) ; port ICSP.PGEC
PGED: U3.16(PGED1/VREF+/CVREF+/AN0/RPB0/PMA6/RB0) ; port ICSP.PGED
RGB: U4.4(Y) ; port RGB
RGB LV: U3.63(RPE3/CTPLS/PMD3/RE3) U4.2(A)
RTS: U3.29(AN14/RPB14/CTED5/PMA1/RB14) ; port UART.RTS
RX: U3.31(RPF4/SDA2/PMA9/RF4) ; port UART.RX
SCL0: R11.2
SCL0 R: R11.1 U3.1(AN22/RPE5/PMD5/RE5)
SCl1: R12.2
SCL1 R: R12.1 U3.2(AN23/PMD6/RE6)
SCL2: R13.2
SCL2 R: R13.1 U3.3(AN27/PMD7/RE7)
SCL3: R14.2
SCL3 R: R14.1 U3.4(AN16/C1IND/RPG6/SCK2/PMA5/RG6)
SCL4: R15.2
SCL4 R: R15.1 U3.5(AN17/C1INC/RPG7/PMA4/RG7)
SCL5: R16.2
SCL5 R: R16.1 U3.6(AN18/C2IND/RPG8/PMA3/RG8)
SCL6: R17.2
SCL6 R: R17.1 U3.8(AN19/C2INC/RPG9/PMA2/RG9)
SCL7: R18.2
SCL7 R: R18.1 U3.11(AN5/C1INA/RPB5/VBUSON/RB5)
SDA0: R3.1 U3.48(SOSCO/RPC14/T1CK/RC14)
SDA1: R4.1 U3.47(SOSCI/RPC13/RC13)
SDA2: R5.1 U3.46(RPD0/INT0/RD0)
SDA3: R6.1 U3.45(RPD11/PMCS1/RD11)
SDA4: R7.1 U3.44(RPD10/SCL1/PMCS2/RD10)
SDA5: R8.1 U3.43(RPD9/SDA1/RD9)
SDA6: R9.1 U3.42(RPD8/RTCC/RD8)
SDA7: R10.1 U3.40(OSC2/CLKO/RC15)
TX: U3.32(RPF5/SCL2/PMA8/RF5) ; port UART.TX
VBUS Detect: R2.1 U3.33(USBID/RF3)
VCAP: C4.2 U3.56(VCAP)

Not connected (* = marked no-connect by the designer): U3 12(AN4/C1INB/RB4) 13(PGED3/AN3/C2INA/RPB3/RB3) 14(PGEC3/AN2/C2INB/RPB2/CTED13/RB2) 17(PGEC2/AN6/RPB6/RB6) 18(PGED2/AN7/RPB7/CTED3//RB7) 21(AN8/RPB8/CTED10//RB8) 22(AN9/RPB9/CTED4/PMA7/RB9) 23(TMS/CVREFOUT/AN10/RPB10/CTED11//PMA13/RB10) 24(TDO/AN11/PMA12/RB11) 27(TCK/AN12/PMA11/RB12) 28(TDI/AN13/PMA10/RB13) 49(AN24/RPD1/RD1) 50(AN25/RPD2/SCK1/RD2) 51(AN26/RPD3/RD3) 52(RPD4/PMWR/RD4) 53(RPD5/PMRD/RD5) 54(RD6) 55(RD7) 58(RPF0/RF0) 59(RPF1/RF1) 60(PMD0/RE0) 61(PMD1/RE1) 62(AN20/PMD2/RE2) 64(AN21/PMD4/RE4); U4 1(N.C.)

### Buses and harness runs
bus SCL[0..7]
bus SDA[0..7]

### Layout directives
differential pair: D_N, D_P

### Notes on the sheet
- @{"Id":"YLBVVCNZ\OIGDGPIJ"} requires PIC32MX internal pull-down
- TITLE
- SIZE
- A3
- VARIANT
- PROJECT
- SHEET
- VERSION
- OF
- AUTHOR
- DATE

### Library data of the parts
C3-C9 = Capacitor
R1-R18 = Resistor
U3 = PIC32MX470F512H
U4 = SN74LVC1xxx (1 Input)
Y1 = Oscillator

## Sheet USB-C.SchDoc
size A4; SheetNumber: 3; SheetTotal: 8
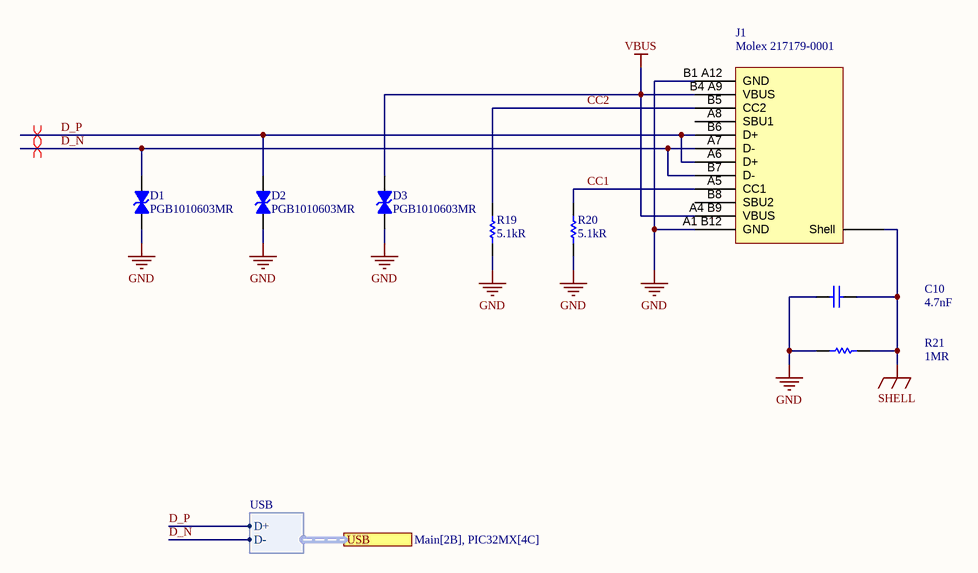
[diagram p4: USB-C.SchDoc]

### Parts
C10  4.7nF  [Capacitor 0603]
D1  PGB1010603MR  [Diode TVS 0603]
D2  PGB1010603MR  [Diode TVS 0603]
D3  PGB1010603MR  [Diode TVS 0603]
J1  Molex 217179-0001  [Molex 217179-0001]
R19  5.1kR  [Resistor 0603]
R20  5.1kR  [Resistor 0603]
R21  1MR  [Resistor 0603]

### Ports
USB (harness USB, see Main[2B], PIC32MX[4C])

### Harnesses
USB: D+, D-

### Nets
GND: C10.1 D1.2 D2.2 D3.2 J1.A1_B12(GND) J1.B1_A12(GND) R19.1 R20.1 R21.2
SHELL: C10.2 J1.Shell R21.1
VBUS: D3.1 J1.A4_B9(VBUS) J1.B4_A9(VBUS)
CC1: J1.A5(CC1) R20.2
CC2: J1.B5(CC2) R19.2
D_N: D1.1 J1.A7(D-) J1.B7(D-) ; port USB.D-
D_P: D2.1 J1.A6(D+) J1.B6(D+) ; port USB.D+

Not connected (* = marked no-connect by the designer): J1 A8(SBU1) B8(SBU2)

### Layout directives
differential pair: D_N, D_P

### Notes on the sheet
- TITLE
- SIZE
- A4
- VARIANT
- PROJECT
- SHEET
- VERSION
- OF
- AUTHOR
- DATE

### Library data of the parts
C10 = Capacitor
D1-D3 = Diode TVS
J1 = USB-C Receptacle (16 Pin)
R19-R21 = Resistor

## Sheet UART.SchDoc
size A4; SheetNumber: 4; SheetTotal: 8
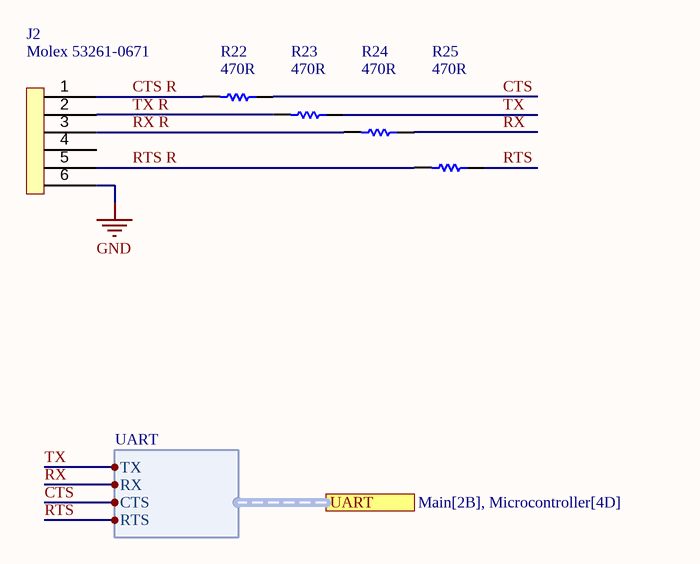
[diagram p5: UART.SchDoc]

### Parts
J2  Molex 53261-0671  [Molex 53261-0671]
R22  470R  [Resistor 0603]
R23  470R  [Resistor 0603]
R24  470R  [Resistor 0603]
R25  470R  [Resistor 0603]

### Ports
UART (harness UART, see Main[2B], Microcontroller[4D])

### Harnesses
UART: TX, RX, CTS, RTS

### Nets
GND: J2.6
CTS: R22.2 ; port UART.CTS
CTS R: J2.1 R22.1
RTS: R25.2 ; port UART.RTS
RTS R: J2.5 R25.1
RX: R24.2 ; port UART.RX
RX R: J2.3 R24.1
TX: R23.2 ; port UART.TX
TX R: J2.2 R23.1

Not connected (* = marked no-connect by the designer): J2 4

### Notes on the sheet
- TITLE
- SIZE
- A4
- VARIANT
- PROJECT
- SHEET
- VERSION
- OF
- AUTHOR
- DATE

### Library data of the parts
R22-R25 = Resistor

## Sheet 3.3V Regulator.SchDoc
size A4; SheetNumber: 8; SheetTotal: 8
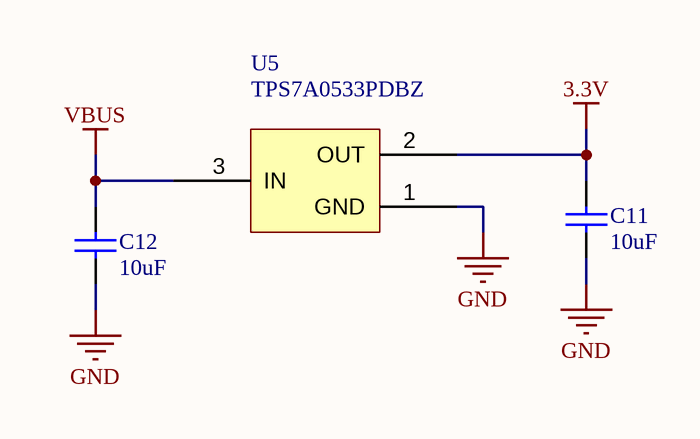
[diagram p6: 3.3V Regulator.SchDoc]

### Parts
C11  10uF  [Capacitor 0603]
C12  10uF  [Capacitor 0603]
U5  TPS7A0533PDBZ  [SOT-23]

### Nets
3.3V: C11.2 U5.2(OUT)
GND: C11.1 C12.1 U5.1(GND)
VBUS: C12.2 U5.3(IN)

### Notes on the sheet
- TITLE
- SIZE
- A4
- VARIANT
- PROJECT
- SHEET
- VERSION
- OF
- AUTHOR
- DATE

### Library data of the parts
C11 C12 = Capacitor

## Sheet ICSP.SchDoc
size A4; SheetNumber: 5; SheetTotal: 8
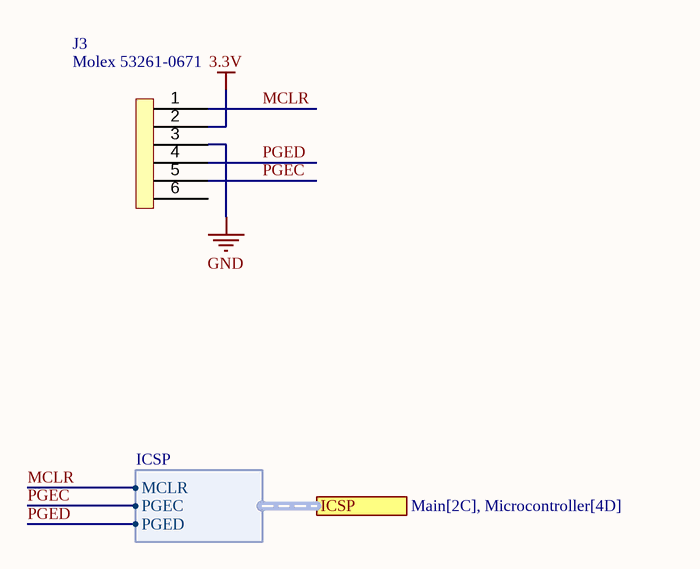
[diagram p7: ICSP.SchDoc]

### Parts
J3  Molex 53261-0671  [Molex 53261-0671]

### Ports
ICSP (harness ICSP, see Main[2C], Microcontroller[4D])

### Harnesses
ICSP: MCLR, PGEC, PGED

### Nets
3.3V: J3.2
GND: J3.3
MCLR: J3.1 ; port ICSP.MCLR
PGEC: J3.5 ; port ICSP.PGEC
PGED: J3.4 ; port ICSP.PGED

Not connected (* = marked no-connect by the designer): J3 6

### Notes on the sheet
- TITLE
- SIZE
- A4
- VARIANT
- PROJECT
- SHEET
- VERSION
- OF
- AUTHOR
- DATE

## Nets that join several sheets
3.3V: Dials/CH1 (C1_CH1.2 U1_CH1.4), Dials/CH2 (C1_CH2.2 U1_CH2.4), Dials/CH3 (C1_CH3.2 U1_CH3.4), Dials/CH4 (C1_CH4.2 U1_CH4.4), Dials/CH5 (C1_CH5.2 U1_CH5.4), Dials/CH6 (C1_CH6.2 U1_CH6.4), Dials/CH7 (C1_CH7.2 U1_CH7.4), Dials/CH8 (C1_CH8.2 U1_CH8.4), Dials/CH9 (C1_CH9.2 U1_CH9.4), Dials/CH10 (C1_CH10.2 U1_CH10.4), Dials/CH11 (C1_CH11.2 U1_CH11.4), Dials/CH12 (C1_CH12.2 U1_CH12.4), Dials/CH13 (C1_CH13.2 U1_CH13.4), Dials/CH14 (C1_CH14.2 U1_CH14.4), Dials/CH15 (C1_CH15.2 U1_CH15.4), Dials/CH16 (C1_CH16.2 U1_CH16.4), Dials/CH17 (C1_CH17.2 U1_CH17.4), Dials/CH18 (C1_CH18.2 U1_CH18.4), Dials/CH19 (C1_CH19.2 U1_CH19.4), Dials/CH20 (C1_CH20.2 U1_CH20.4), Dials/CH21 (C1_CH21.2 U1_CH21.4), Dials/CH22 (C1_CH22.2 U1_CH22.4), Dials/CH23 (C1_CH23.2 U1_CH23.4), Dials/CH24 (C1_CH24.2 U1_CH24.4), Dials/CH25 (C1_CH25.2 U1_CH25.4), Dials/CH26 (C1_CH26.2 U1_CH26.4), Dials/CH27 (C1_CH27.2 U1_CH27.4), Dials/CH28 (C1_CH28.2 U1_CH28.4), Dials/CH29 (C1_CH29.2 U1_CH29.4), Dials/CH30 (C1_CH30.2 U1_CH30.4), Dials/CH31 (C1_CH31.2 U1_CH31.4), Dials/CH32 (C1_CH32.2 U1_CH32.4), Dials/CH33 (C1_CH33.2 U1_CH33.4), Dials/CH34 (C1_CH34.2 U1_CH34.4), Dials/CH35 (C1_CH35.2 U1_CH35.4), Dials/CH36 (C1_CH36.2 U1_CH36.4), Dials/CH37 (C1_CH37.2 U1_CH37.4), Dials/CH38 (C1_CH38.2 U1_CH38.4), Dials/CH39 (C1_CH39.2 U1_CH39.4), Dials/CH40 (C1_CH40.2 U1_CH40.4), Dials/CH41 (C1_CH41.2 U1_CH41.4), Dials/CH42 (C1_CH42.2 U1_CH42.4), Dials/CH43 (C1_CH43.2 U1_CH43.4), Dials/CH44 (C1_CH44.2 U1_CH44.4), Dials/CH45 (C1_CH45.2 U1_CH45.4), Dials/CH46 (C1_CH46.2 U1_CH46.4), Dials/CH47 (C1_CH47.2 U1_CH47.4), Dials/CH48 (C1_CH48.2 U1_CH48.4), Dials/CH49 (C1_CH49.2 U1_CH49.4), Dials/CH50 (C1_CH50.2 U1_CH50.4), Dials/CH51 (C1_CH51.2 U1_CH51.4), Dials/CH52 (C1_CH52.2 U1_CH52.4), Dials/CH53 (C1_CH53.2 U1_CH53.4), Dials/CH54 (C1_CH54.2 U1_CH54.4), Dials/CH55 (C1_CH55.2 U1_CH55.4), Dials/CH56 (C1_CH56.2 U1_CH56.4), Dials/CH57 (C1_CH57.2 U1_CH57.4), Dials/CH58 (C1_CH58.2 U1_CH58.4), Dials/CH59 (C1_CH59.2 U1_CH59.4), Dials/CH60 (C1_CH60.2 U1_CH60.4), Dials/CH61 (C1_CH61.2 U1_CH61.4), Dials/CH62 (C1_CH62.2 U1_CH62.4), Dials/CH63 (C1_CH63.2 U1_CH63.4), Dials/CH64 (C1_CH64.2 U1_CH64.4), PIC32MX (22 pins), 3.3V Regulator (C11.2 U5.2), ICSP (J3.2)
GND: Dials/CH1 (6 pins), Dials/CH2 (6 pins), Dials/CH3 (6 pins), Dials/CH4 (6 pins), Dials/CH5 (6 pins), Dials/CH6 (6 pins), Dials/CH7 (6 pins), Dials/CH8 (6 pins), Dials/CH9 (6 pins), Dials/CH10 (6 pins), Dials/CH11 (6 pins), Dials/CH12 (6 pins), Dials/CH13 (6 pins), Dials/CH14 (6 pins), Dials/CH15 (6 pins), Dials/CH16 (6 pins), Dials/CH17 (6 pins), Dials/CH18 (6 pins), Dials/CH19 (6 pins), Dials/CH20 (6 pins), Dials/CH21 (6 pins), Dials/CH22 (6 pins), Dials/CH23 (6 pins), Dials/CH24 (6 pins), Dials/CH25 (6 pins), Dials/CH26 (6 pins), Dials/CH27 (6 pins), Dials/CH28 (6 pins), Dials/CH29 (6 pins), Dials/CH30 (6 pins), Dials/CH31 (6 pins), Dials/CH32 (6 pins), Dials/CH33 (6 pins), Dials/CH34 (6 pins), Dials/CH35 (6 pins), Dials/CH36 (6 pins), Dials/CH37 (6 pins), Dials/CH38 (6 pins), Dials/CH39 (6 pins), Dials/CH40 (6 pins), Dials/CH41 (6 pins), Dials/CH42 (6 pins), Dials/CH43 (6 pins), Dials/CH44 (6 pins), Dials/CH45 (6 pins), Dials/CH46 (6 pins), Dials/CH47 (6 pins), Dials/CH48 (6 pins), Dials/CH49 (6 pins), Dials/CH50 (6 pins), Dials/CH51 (6 pins), Dials/CH52 (6 pins), Dials/CH53 (6 pins), Dials/CH54 (6 pins), Dials/CH55 (6 pins), Dials/CH56 (6 pins), Dials/CH57 (6 pins), Dials/CH58 (6 pins), Dials/CH59 (6 pins), Dials/CH60 (6 pins), Dials/CH61 (6 pins), Dials/CH62 (6 pins), Dials/CH63 (6 pins), Dials/CH64 (6 pins), PIC32MX (13 pins), USB-C (9 pins), UART (J2.6), 3.3V Regulator (C11.1 C12.1 U5.1), ICSP (J3.3)
VBUS: Dials/CH1 (C2_CH1.2 U2_CH1.1), Dials/CH2 (C2_CH2.2 U2_CH2.1), Dials/CH3 (C2_CH3.2 U2_CH3.1), Dials/CH4 (C2_CH4.2 U2_CH4.1), Dials/CH5 (C2_CH5.2 U2_CH5.1), Dials/CH6 (C2_CH6.2 U2_CH6.1), Dials/CH7 (C2_CH7.2 U2_CH7.1), Dials/CH8 (C2_CH8.2 U2_CH8.1), Dials/CH9 (C2_CH9.2 U2_CH9.1), Dials/CH10 (C2_CH10.2 U2_CH10.1), Dials/CH11 (C2_CH11.2 U2_CH11.1), Dials/CH12 (C2_CH12.2 U2_CH12.1), Dials/CH13 (C2_CH13.2 U2_CH13.1), Dials/CH14 (C2_CH14.2 U2_CH14.1), Dials/CH15 (C2_CH15.2 U2_CH15.1), Dials/CH16 (C2_CH16.2 U2_CH16.1), Dials/CH17 (C2_CH17.2 U2_CH17.1), Dials/CH18 (C2_CH18.2 U2_CH18.1), Dials/CH19 (C2_CH19.2 U2_CH19.1), Dials/CH20 (C2_CH20.2 U2_CH20.1), Dials/CH21 (C2_CH21.2 U2_CH21.1), Dials/CH22 (C2_CH22.2 U2_CH22.1), Dials/CH23 (C2_CH23.2 U2_CH23.1), Dials/CH24 (C2_CH24.2 U2_CH24.1), Dials/CH25 (C2_CH25.2 U2_CH25.1), Dials/CH26 (C2_CH26.2 U2_CH26.1), Dials/CH27 (C2_CH27.2 U2_CH27.1), Dials/CH28 (C2_CH28.2 U2_CH28.1), Dials/CH29 (C2_CH29.2 U2_CH29.1), Dials/CH30 (C2_CH30.2 U2_CH30.1), Dials/CH31 (C2_CH31.2 U2_CH31.1), Dials/CH32 (C2_CH32.2 U2_CH32.1), Dials/CH33 (C2_CH33.2 U2_CH33.1), Dials/CH34 (C2_CH34.2 U2_CH34.1), Dials/CH35 (C2_CH35.2 U2_CH35.1), Dials/CH36 (C2_CH36.2 U2_CH36.1), Dials/CH37 (C2_CH37.2 U2_CH37.1), Dials/CH38 (C2_CH38.2 U2_CH38.1), Dials/CH39 (C2_CH39.2 U2_CH39.1), Dials/CH40 (C2_CH40.2 U2_CH40.1), Dials/CH41 (C2_CH41.2 U2_CH41.1), Dials/CH42 (C2_CH42.2 U2_CH42.1), Dials/CH43 (C2_CH43.2 U2_CH43.1), Dials/CH44 (C2_CH44.2 U2_CH44.1), Dials/CH45 (C2_CH45.2 U2_CH45.1), Dials/CH46 (C2_CH46.2 U2_CH46.1), Dials/CH47 (C2_CH47.2 U2_CH47.1), Dials/CH48 (C2_CH48.2 U2_CH48.1), Dials/CH49 (C2_CH49.2 U2_CH49.1), Dials/CH50 (C2_CH50.2 U2_CH50.1), Dials/CH51 (C2_CH51.2 U2_CH51.1), Dials/CH52 (C2_CH52.2 U2_CH52.1), Dials/CH53 (C2_CH53.2 U2_CH53.1), Dials/CH54 (C2_CH54.2 U2_CH54.1), Dials/CH55 (C2_CH55.2 U2_CH55.1), Dials/CH56 (C2_CH56.2 U2_CH56.1), Dials/CH57 (C2_CH57.2 U2_CH57.1), Dials/CH58 (C2_CH58.2 U2_CH58.1), Dials/CH59 (C2_CH59.2 U2_CH59.1), Dials/CH60 (C2_CH60.2 U2_CH60.1), Dials/CH61 (C2_CH61.2 U2_CH61.1), Dials/CH62 (C2_CH62.2 U2_CH62.1), Dials/CH63 (C2_CH63.2 U2_CH63.1), Dials/CH64 (C2_CH64.2 U2_CH64.1), PIC32MX (C9.2 R2.2 U3.34 U4.5), USB-C (D3.1 J1.A4 B9 J1.B4 A9), 3.3V Regulator (C12.2 U5.3)
CTS: PIC32MX (U3.30), UART (R22.2)
D1: Dials/CH1 (U2_CH1.2), Dials/CH2 (U2_CH2.4)
D2: Dials/CH2 (U2_CH2.2), Dials/CH3 (U2_CH3.4)
D3: Dials/CH3 (U2_CH3.2), Dials/CH4 (U2_CH4.4)
D4: Dials/CH4 (U2_CH4.2), Dials/CH5 (U2_CH5.4)
D5: Dials/CH5 (U2_CH5.2), Dials/CH6 (U2_CH6.4)
D6: Dials/CH6 (U2_CH6.2), Dials/CH7 (U2_CH7.4)
D7: Dials/CH7 (U2_CH7.2), Dials/CH8 (U2_CH8.4)
D8: Dials/CH8 (U2_CH8.2), Dials/CH9 (U2_CH9.4)
D9: Dials/CH9 (U2_CH9.2), Dials/CH10 (U2_CH10.4)
D10: Dials/CH10 (U2_CH10.2), Dials/CH11 (U2_CH11.4)
D11: Dials/CH11 (U2_CH11.2), Dials/CH12 (U2_CH12.4)
D12: Dials/CH12 (U2_CH12.2), Dials/CH13 (U2_CH13.4)
D13: Dials/CH13 (U2_CH13.2), Dials/CH14 (U2_CH14.4)
D14: Dials/CH14 (U2_CH14.2), Dials/CH15 (U2_CH15.4)
D15: Dials/CH15 (U2_CH15.2), Dials/CH16 (U2_CH16.4)
D16: Dials/CH16 (U2_CH16.2), Dials/CH17 (U2_CH17.4)
D17: Dials/CH17 (U2_CH17.2), Dials/CH18 (U2_CH18.4)
D18: Dials/CH18 (U2_CH18.2), Dials/CH19 (U2_CH19.4)
D19: Dials/CH19 (U2_CH19.2), Dials/CH20 (U2_CH20.4)
D20: Dials/CH20 (U2_CH20.2), Dials/CH21 (U2_CH21.4)
D21: Dials/CH21 (U2_CH21.2), Dials/CH22 (U2_CH22.4)
D22: Dials/CH22 (U2_CH22.2), Dials/CH23 (U2_CH23.4)
D23: Dials/CH23 (U2_CH23.2), Dials/CH24 (U2_CH24.4)
D24: Dials/CH24 (U2_CH24.2), Dials/CH25 (U2_CH25.4)
D25: Dials/CH25 (U2_CH25.2), Dials/CH26 (U2_CH26.4)
D26: Dials/CH26 (U2_CH26.2), Dials/CH27 (U2_CH27.4)
D27: Dials/CH27 (U2_CH27.2), Dials/CH28 (U2_CH28.4)
D28: Dials/CH28 (U2_CH28.2), Dials/CH29 (U2_CH29.4)
D29: Dials/CH29 (U2_CH29.2), Dials/CH30 (U2_CH30.4)
D30: Dials/CH30 (U2_CH30.2), Dials/CH31 (U2_CH31.4)
D31: Dials/CH31 (U2_CH31.2), Dials/CH32 (U2_CH32.4)
D32: Dials/CH32 (U2_CH32.2), Dials/CH33 (U2_CH33.4)
D33: Dials/CH33 (U2_CH33.2), Dials/CH34 (U2_CH34.4)
D34: Dials/CH34 (U2_CH34.2), Dials/CH35 (U2_CH35.4)
D35: Dials/CH35 (U2_CH35.2), Dials/CH36 (U2_CH36.4)
D36: Dials/CH36 (U2_CH36.2), Dials/CH37 (U2_CH37.4)
D37: Dials/CH37 (U2_CH37.2), Dials/CH38 (U2_CH38.4)
D38: Dials/CH38 (U2_CH38.2), Dials/CH39 (U2_CH39.4)
D39: Dials/CH39 (U2_CH39.2), Dials/CH40 (U2_CH40.4)
D40: Dials/CH40 (U2_CH40.2), Dials/CH41 (U2_CH41.4)
D41: Dials/CH41 (U2_CH41.2), Dials/CH42 (U2_CH42.4)
D42: Dials/CH42 (U2_CH42.2), Dials/CH43 (U2_CH43.4)
D43: Dials/CH43 (U2_CH43.2), Dials/CH44 (U2_CH44.4)
D44: Dials/CH44 (U2_CH44.2), Dials/CH45 (U2_CH45.4)
D45: Dials/CH45 (U2_CH45.2), Dials/CH46 (U2_CH46.4)
D46: Dials/CH46 (U2_CH46.2), Dials/CH47 (U2_CH47.4)
D47: Dials/CH47 (U2_CH47.2), Dials/CH48 (U2_CH48.4)
D48: Dials/CH48 (U2_CH48.2), Dials/CH49 (U2_CH49.4)
D49: Dials/CH49 (U2_CH49.2), Dials/CH50 (U2_CH50.4)
D50: Dials/CH50 (U2_CH50.2), Dials/CH51 (U2_CH51.4)
D51: Dials/CH51 (U2_CH51.2), Dials/CH52 (U2_CH52.4)
D52: Dials/CH52 (U2_CH52.2), Dials/CH53 (U2_CH53.4)
D53: Dials/CH53 (U2_CH53.2), Dials/CH54 (U2_CH54.4)
D54: Dials/CH54 (U2_CH54.2), Dials/CH55 (U2_CH55.4)
D55: Dials/CH55 (U2_CH55.2), Dials/CH56 (U2_CH56.4)
D56: Dials/CH56 (U2_CH56.2), Dials/CH57 (U2_CH57.4)
D57: Dials/CH57 (U2_CH57.2), Dials/CH58 (U2_CH58.4)
D58: Dials/CH58 (U2_CH58.2), Dials/CH59 (U2_CH59.4)
D59: Dials/CH59 (U2_CH59.2), Dials/CH60 (U2_CH60.4)
D60: Dials/CH60 (U2_CH60.2), Dials/CH61 (U2_CH61.4)
D61: Dials/CH61 (U2_CH61.2), Dials/CH62 (U2_CH62.4)
D62: Dials/CH62 (U2_CH62.2), Dials/CH63 (U2_CH63.4)
D63: Dials/CH63 (U2_CH63.2), Dials/CH64 (U2_CH64.4)
D_N: PIC32MX (U3.36), USB-C (D1.1 J1.A7 J1.B7)
D_P: PIC32MX (U3.37), USB-C (D2.1 J1.A6 J1.B6)
MCLR: PIC32MX (R1.1 U3.7), ICSP (J3.1)
PGEC: PIC32MX (U3.15), ICSP (J3.5)
PGED: PIC32MX (U3.16), ICSP (J3.4)
RGB: Dials/CH1 (U2_CH1.4), PIC32MX (U4.4)
RTS: PIC32MX (U3.29), UART (R25.2)
RX: PIC32MX (U3.31), UART (R24.2)
SCL0: Dials/CH1 (U1_CH1.1), Dials/CH2 (U1_CH2.1), Dials/CH3 (U1_CH3.1), Dials/CH4 (U1_CH4.1), Dials/CH5 (U1_CH5.1), Dials/CH6 (U1_CH6.1), Dials/CH7 (U1_CH7.1), Dials/CH8 (U1_CH8.1), PIC32MX (R11.2)
SCl1: Dials/CH9 (U1_CH9.1), Dials/CH10 (U1_CH10.1), Dials/CH11 (U1_CH11.1), Dials/CH12 (U1_CH12.1), Dials/CH13 (U1_CH13.1), Dials/CH14 (U1_CH14.1), Dials/CH15 (U1_CH15.1), Dials/CH16 (U1_CH16.1), PIC32MX (R12.2)
SCL2: Dials/CH17 (U1_CH17.1), Dials/CH18 (U1_CH18.1), Dials/CH19 (U1_CH19.1), Dials/CH20 (U1_CH20.1), Dials/CH21 (U1_CH21.1), Dials/CH22 (U1_CH22.1), Dials/CH23 (U1_CH23.1), Dials/CH24 (U1_CH24.1), PIC32MX (R13.2)
SCL3: Dials/CH25 (U1_CH25.1), Dials/CH26 (U1_CH26.1), Dials/CH27 (U1_CH27.1), Dials/CH28 (U1_CH28.1), Dials/CH29 (U1_CH29.1), Dials/CH30 (U1_CH30.1), Dials/CH31 (U1_CH31.1), Dials/CH32 (U1_CH32.1), PIC32MX (R14.2)
SCL4: Dials/CH33 (U1_CH33.1), Dials/CH34 (U1_CH34.1), Dials/CH35 (U1_CH35.1), Dials/CH36 (U1_CH36.1), Dials/CH37 (U1_CH37.1), Dials/CH38 (U1_CH38.1), Dials/CH39 (U1_CH39.1), Dials/CH40 (U1_CH40.1), PIC32MX (R15.2)
SCL5: Dials/CH41 (U1_CH41.1), Dials/CH42 (U1_CH42.1), Dials/CH43 (U1_CH43.1), Dials/CH44 (U1_CH44.1), Dials/CH45 (U1_CH45.1), Dials/CH46 (U1_CH46.1), Dials/CH47 (U1_CH47.1), Dials/CH48 (U1_CH48.1), PIC32MX (R16.2)
SCL6: Dials/CH49 (U1_CH49.1), Dials/CH50 (U1_CH50.1), Dials/CH51 (U1_CH51.1), Dials/CH52 (U1_CH52.1), Dials/CH53 (U1_CH53.1), Dials/CH54 (U1_CH54.1), Dials/CH55 (U1_CH55.1), Dials/CH56 (U1_CH56.1), PIC32MX (R17.2)
SCL7: Dials/CH57 (U1_CH57.1), Dials/CH58 (U1_CH58.1), Dials/CH59 (U1_CH59.1), Dials/CH60 (U1_CH60.1), Dials/CH61 (U1_CH61.1), Dials/CH62 (U1_CH62.1), Dials/CH63 (U1_CH63.1), Dials/CH64 (U1_CH64.1), PIC32MX (R18.2)
SDA0: Dials/CH1 (U1_CH1.6), Dials/CH9 (U1_CH9.6), Dials/CH17 (U1_CH17.6), Dials/CH25 (U1_CH25.6), Dials/CH33 (U1_CH33.6), Dials/CH41 (U1_CH41.6), Dials/CH49 (U1_CH49.6), Dials/CH57 (U1_CH57.6), PIC32MX (R3.1 U3.48)
SDA1: Dials/CH2 (U1_CH2.6), Dials/CH10 (U1_CH10.6), Dials/CH18 (U1_CH18.6), Dials/CH26 (U1_CH26.6), Dials/CH34 (U1_CH34.6), Dials/CH42 (U1_CH42.6), Dials/CH50 (U1_CH50.6), Dials/CH58 (U1_CH58.6), PIC32MX (R4.1 U3.47)
SDA2: Dials/CH3 (U1_CH3.6), Dials/CH11 (U1_CH11.6), Dials/CH19 (U1_CH19.6), Dials/CH27 (U1_CH27.6), Dials/CH35 (U1_CH35.6), Dials/CH43 (U1_CH43.6), Dials/CH51 (U1_CH51.6), Dials/CH59 (U1_CH59.6), PIC32MX (R5.1 U3.46)
SDA3: Dials/CH4 (U1_CH4.6), Dials/CH12 (U1_CH12.6), Dials/CH20 (U1_CH20.6), Dials/CH28 (U1_CH28.6), Dials/CH36 (U1_CH36.6), Dials/CH44 (U1_CH44.6), Dials/CH52 (U1_CH52.6), Dials/CH60 (U1_CH60.6), PIC32MX (R6.1 U3.45)
SDA4: Dials/CH5 (U1_CH5.6), Dials/CH13 (U1_CH13.6), Dials/CH21 (U1_CH21.6), Dials/CH29 (U1_CH29.6), Dials/CH37 (U1_CH37.6), Dials/CH45 (U1_CH45.6), Dials/CH53 (U1_CH53.6), Dials/CH61 (U1_CH61.6), PIC32MX (R7.1 U3.44)
SDA5: Dials/CH6 (U1_CH6.6), Dials/CH14 (U1_CH14.6), Dials/CH22 (U1_CH22.6), Dials/CH30 (U1_CH30.6), Dials/CH38 (U1_CH38.6), Dials/CH46 (U1_CH46.6), Dials/CH54 (U1_CH54.6), Dials/CH62 (U1_CH62.6), PIC32MX (R8.1 U3.43)
SDA6: Dials/CH7 (U1_CH7.6), Dials/CH15 (U1_CH15.6), Dials/CH23 (U1_CH23.6), Dials/CH31 (U1_CH31.6), Dials/CH39 (U1_CH39.6), Dials/CH47 (U1_CH47.6), Dials/CH55 (U1_CH55.6), Dials/CH63 (U1_CH63.6), PIC32MX (R9.1 U3.42)
SDA7: Dials/CH8 (U1_CH8.6), Dials/CH16 (U1_CH16.6), Dials/CH24 (U1_CH24.6), Dials/CH32 (U1_CH32.6), Dials/CH40 (U1_CH40.6), Dials/CH48 (U1_CH48.6), Dials/CH56 (U1_CH56.6), Dials/CH64 (U1_CH64.6), PIC32MX (R10.1 U3.40)
TX: PIC32MX (U3.32), UART (R23.2)